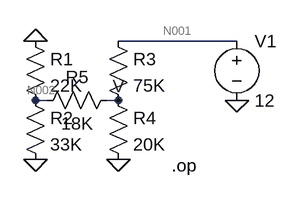
[diagram p0: schematic Draft1.asc]
Draft1.asc, the LTspice schematic file:
Version 4
SHEET 1 880 680
WIRE 368 96 208 96
WIRE 112 176 96 176
WIRE 208 176 192 176
FLAG 96 256 0
FLAG 208 256 0
FLAG 368 176 0
FLAG 208 176 V
FLAG 96 96 0
SYMBOL res 80 80 R0
SYMATTR InstName R1
SYMATTR Value 22K
SYMBOL res 80 160 R0
SYMATTR InstName R2
SYMATTR Value 33K
SYMBOL res 192 80 R0
SYMATTR InstName R3
SYMATTR Value 75K
SYMBOL res 192 160 R0
SYMATTR InstName R4
SYMATTR Value 20K
SYMBOL res 208 160 R90
WINDOW 0 0 56 VBottom 2
WINDOW 3 32 56 VTop 2
SYMATTR InstName R5
SYMATTR Value 18K
SYMBOL voltage 368 80 R0
WINDOW 123 0 0 Left 0
WINDOW 39 0 0 Left 0
SYMATTR InstName V1
SYMATTR Value 12
TEXT 280 264 Left 2 !.op

The netlist it stands for:
* Draft1.asc
R1 0 N002 22K
R2 N002 0 33K
R3 N001 V 75K
R4 V 0 20K
R5 V N002 18K
V1 N001 0 12
.op
.backanno
.end

* Results of the author's LTspice run, read from the files saved beside the schematic
* Operating Point:
*   V(n002) = 709.7 mV
*   V(n001) = 12 V
*   V(v) = 1.677 V
*   I(R1) = -32.26 µA
*   I(R2) = 21.51 µA
*   I(R3) = 137.6 µA
*   I(R4) = 83.87 µA
*   I(R5) = 53.76 µA
*   I(V1) = -137.6 µA